# Altium schematic sheet 01_power.SchDoc
size A4; SheetNumber: 4; SheetTotal: 4
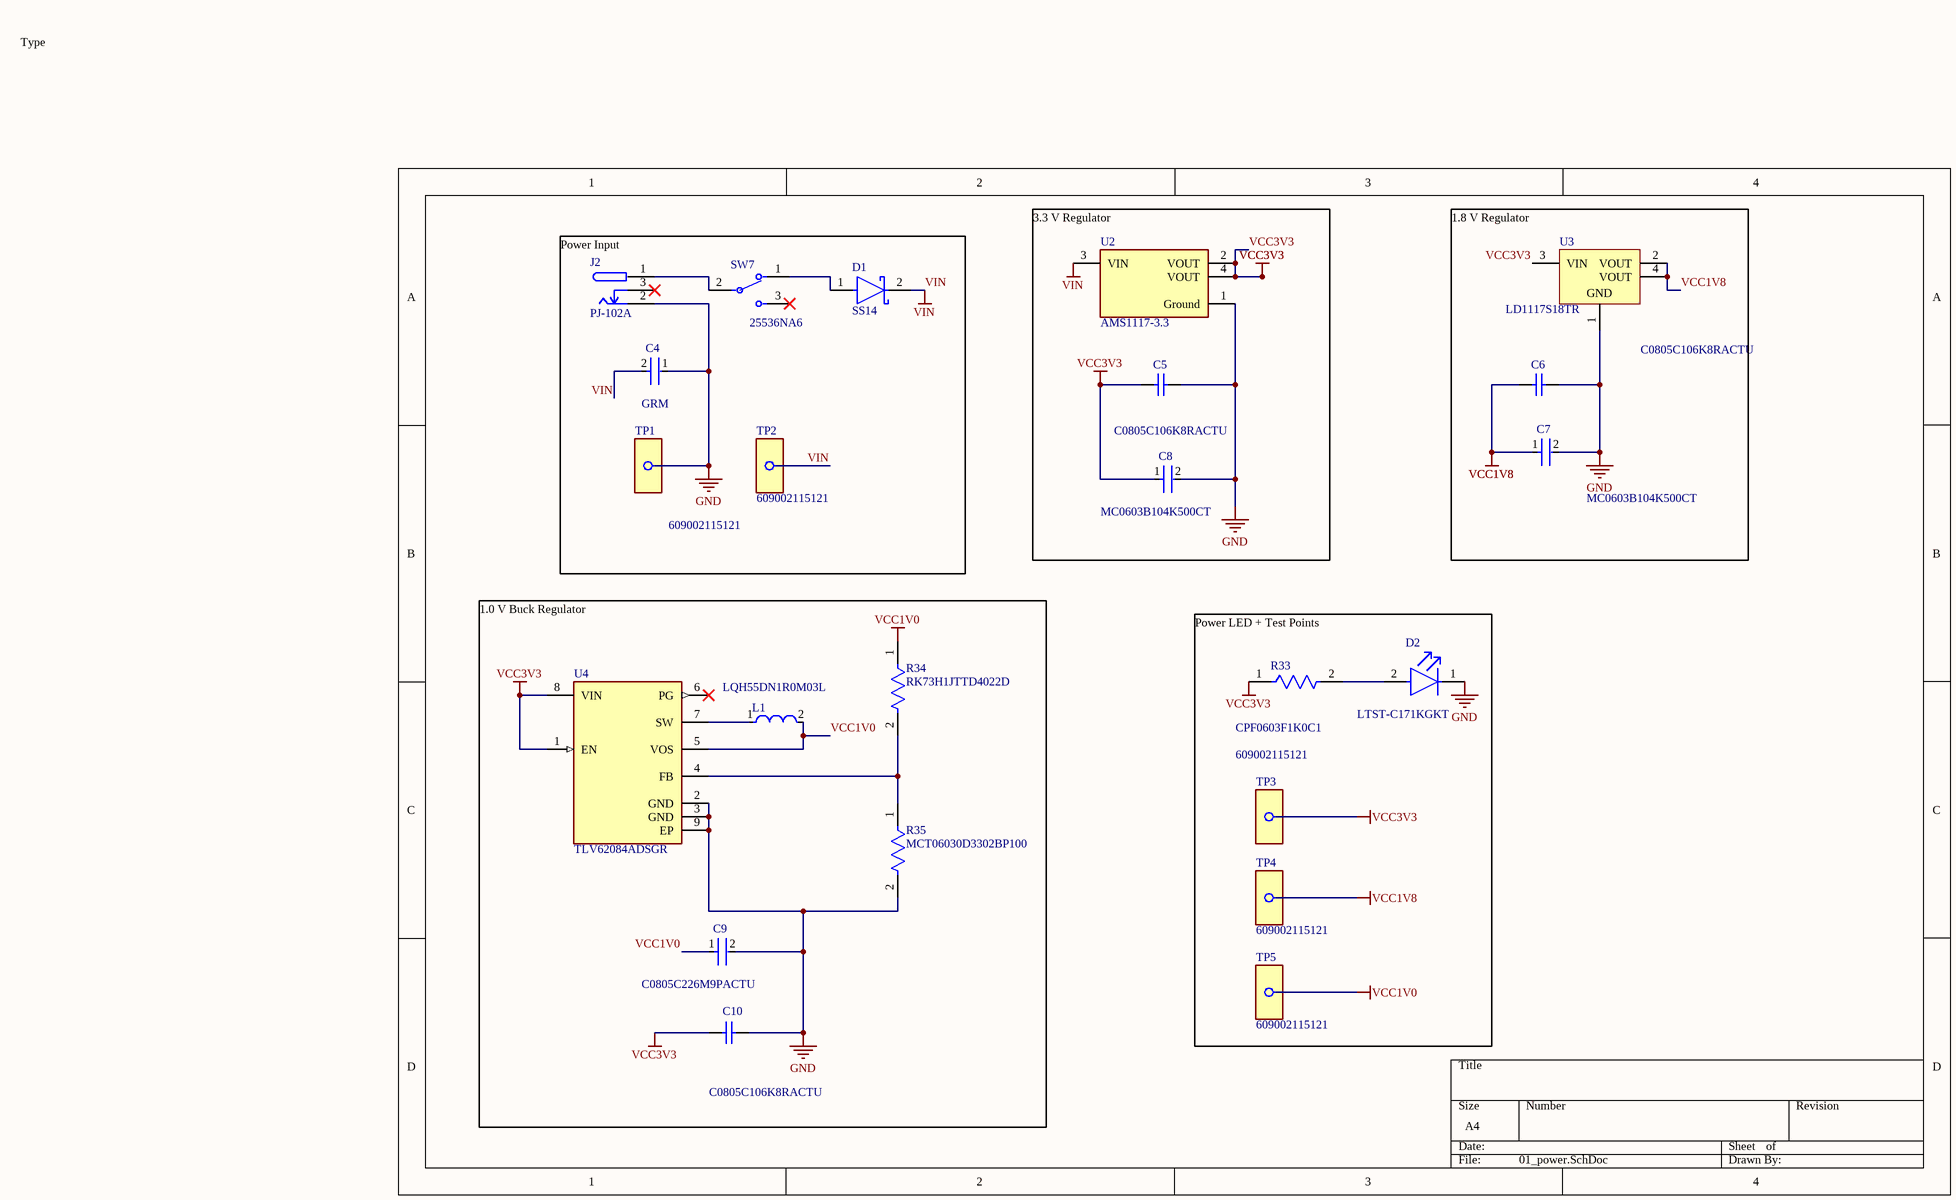
[diagram p0: 01_power.SchDoc]

## Parts
C4  GRM  [FP-GRM31C-0_3-e0_3_0_8-IPC_C]
C5  C0805C106K8RACTU  [CAPC2013X145X50LL20T25]
C6  C0805C106K8RACTU  [CAPC2013X145X50LL20T25]
C7  MC0603B104K500CT  [FP-MC0603-IPC_C]
C8  MC0603B104K500CT  [FP-MC0603-IPC_C]
C9  C0805C226M9PACTU  [FP-C0805C226M9PACTU-MFG]
C10  C0805C106K8RACTU  [CAPC2013X145X50LL20T25]
D1  SS14  [FP-403AE-MFG]
D2  LTST-C171KGKT  [FP-LTST-C171KGKT-MFG]
J2  PJ-102A  [FP-PJ-102A-MFG]
L1  LQH55DN1R0M03L  [FP-LQH55DN_03-MFG]
R33  CPF0603F1K0C1  [FP-CPF0603-MFG]
R34  RK73H1JTTD4022D  [FP-RK73H1J-MFG]
R35  MCT06030D3302BP100  [FP-MCT0603-IPC_B]
SW7  25536NA6  [FP-25536NA6-0]
TP1  609002115121  [FP-609002115121-MFG]
TP2  609002115121  [FP-609002115121-MFG]
TP3  609002115121  [FP-609002115121-MFG]
TP4  609002115121  [FP-609002115121-MFG]
TP5  609002115121  [FP-609002115121-MFG]
U2  AMS1117-3.3  [FP-AMS1117-IPC_C]
U3  LD1117S18TR  [SOT-223_M]
U4  TLV62084ADSGR  [FP-DSG0008A-IPC_C]

## Nets
GND: C4.1 C5.2 C6.2 C7.2 C8.2 C9.2 C10.2 D2.1(C) J2.2 R35.2 U2.1(Ground) U3.1(GND) U4.2(GND) U4.3(GND) U4.9(EP)
VCC1V0: C9.1 L1.2 R34.1 U4.5(VOS)
VCC1V8: C6.1 C7.1 U3.2(VOUT) U3.4(VOUT)
VCC3V3: C5.1 C8.1 C10.1 R33.1 U2.2(VOUT) U2.4(VOUT) U3.3(VIN) U4.1(EN) U4.8(VIN)
VIN: C4.2 D1.2(C) U2.3(VIN)
NetD1_1: D1.1(A) SW7.1
NetD2_2: D2.2(A) R33.2
NetJ2_1: J2.1 SW7.2
NetL1_1: L1.1 U4.7(SW)
NetR34_2: R34.2 R35.1 U4.4(FB)

Not connected (* = marked no-connect by the designer): J2 3*; SW7 3*; U4 6(PG)*

## Notes on the sheet
- Type @ to refer to a designator
- Power Input
- 3.3 V Regulator
- 1.8 V Regulator
- Power LED + Test Points
- 1.0 V Buck Regulator

## Library data of the parts
C4 = CMP-06035-011430-1: Chip Multilayer Ceramic Capacitors for General Purpose, 1206, 47uF, X5R, 15%, 20%, 16V; Capacitance: 47uF; Length: 3.2mm; Thickness: 1.6mm; Width: 1.6mm; Voltage Rating (DC): 16V; Tolerance: 20%; Dielectric: X5R
C5 C6 C10 = CMP-2007-01044-1: Manufacturer: Kemet; Part Number: C0805C106K8RACTU
C7 C8 = CMP-12266-000001-1: Ceramic Capacitor, Multilayer, Ceramic, 50V, 10% +Tol, 10% -Tol, X7R, -/+15ppm/Cel TC, 0.1uF, 0603; Capacitance: 100nF; Case Code (Imperial): 0603; Dielectric: X7R; Max Operating Temperature: 125°C; Packaging: Cut Tape; Min Operating Temperature: -55°C; Voltage Rating (DC): 50V; Tolerance: 10%; RoHS Compliant: Yes; Number of Pins: 2; Case/Package: 0603; Voltage Rating: 50V; Case Code (Metric): 1608
C9 = CMP-2007-01021-2: CAP CER 22UF 6.3V X5R 0805; Tolerance: 20%; Dielectric Material: Ceramic; Dissipation Factor: 5%; RoHS Compliant: Yes; Capacitance: 22uF; Packaging: Tape and Reel; Voltage: 6.3V; Package Quantity: 2500; Width: 1.2mm; Construction: Flat; Radiation Hardening: No; Lead Free: Lead Free; Voltage Rating (DC): 6.3V; Termination: SMD/SMT; Voltage Rating: 6.3V; Height: 1.25mm; Depth: 1.25mm; Max Operating Temperature: 85°C; Dielectric: X5R; Case/Package: 0805; Case Code (Imperial): 0805; Min Operating Temperature: -55°C; REACH SVHC: No SVHC; Mount: Surface Mount; Length: 2mm; Number of Pins: 2; Case Code (Metric): 2012
D1 = CMP-2000-04943-2: DIODE SCHOTTKY 40V 1A SMA; Manufacturer: ON Semiconductor; Peak Reverse Current: 0.2mA; Max Junction Temp: +125°C; Standoff Height: 0.05mm; Max Surge Forward Current: 40A; Mouser Description: Schottky Diodes & Rectifiers SMA 40V 1.0A; RoHS: TRUE; Lead Free: Yes; Manufacturer Part Number: SS14; Device Class L3: Schottky Diodes; Category: Diode; Automotive: No; Digikey Description: DIODE SCHOTTKY 40V 1A SMA; ComponentLink2Description: Datasheet; Device Class L2: Diodes; Height: 2.5mm; Temperature Range High: +125°C; ComponentLink2URL: https://www.onsemi.com/pub/Collateral/SS19-D.PDF; Device Class L1: Discrete Semiconductors; Package: 403AE; Octopart: https://octopart.com/ss14-on+semiconductor-29205033; Max Repetitive Reverse Voltage: 40V; Temperature Range Low: -65°C; Forward Current: 1A; Temperature: -65°C to +125°C
D2 = CMP-22017-000037-1: LED GREEN CLEAR SMD; Number of LEDs: 1; Viewing Angle: 130°; Lens Style: Rectangular; Dominant Wavelength: 571nm; Test Current: 20mA; Luminous Intensity: 35mcd; Power Rating: 75mW; Forward Voltage: 2.4V; Forward Current: 30mA; Reverse Voltage: 5V; Lens Color: Colorless; Wavelength: 574nm; Height: 0.8mm; Illumination Color: Green; Length: 2mm; Case/Package: 0805; Number of Pins: 2; Number of Elements: 1; Package Quantity: 1; Depth: 1.25mm; Lens Transparency: Clear; Width: 1.25mm; Color: Green; Radiation Hardening: No; Mount: Surface Mount; Packaging: Tape and Reel; Case Code (Metric): 2012; Lead Free: Lead Free; Max Operating Temperature: 85°C; Min Operating Temperature: -55°C; Case Code (Imperial): 0805; Power Dissipation: 75mW
J2 = CMP-12637-106234071-1: PJ-102A 2.0 x 6.5 mm, 2.5 A, Horizontal, Through Hole, Tapered Pins, Dc Power Jack Connector; Voltage Rating (DC): 24V; Number of Contacts: 3; Outside Diameter: 6.5mm; Gender: Male; Shielding: No; Insulation Resistance: 50MΩ; Current Rating: 2.5A; Inside Diameter: 2mm; Number of Conductors: 2; Housing Color: Black; RoHS: Compliant; Diameter: 2.1mm; Mount: Through Hole; Contact Plating: Nickel; NexarPartId: 106234071; Voltage Rating: 24V; Housing Material: Thermoplastic; Max Operating Temperature: 85°C; Color: Black; Contact Material: Copper, Nickel, Tin; Orientation: Horizontal; Packaging: Bulk; Flammability Rating: UL94 V-0; Schedule B: 8536695050, 8536695050; Contact Gender: Male; Lead Free: Lead Free; Termination: Through Hole; Min Operating Temperature: -25°C; Height: 11.2mm; Lifecycle Status: Production
L1 = CMP-06042-004508-1: Wire Wound Ferrite Inductor for Power Lines 1μH ±20% 0.0266Ω  4.0A 2220; Current Rating: 4A; Series Resistance: 19mR; DC Resistance (DCR): 26.6mR; Inductance: 1uH; Shielding: Unshielded; Test Frequency: 1MHz; Self Resonant Frequency: 150MHz; Mount: Surface Mount; Depth: 5.3mm; Weight: 0.016932oz; Min Operating Temperature: -40°C; Number of Pins: 2; Max Operating Temperature: 80°C; Military Standard: Not; Tolerance: 20%; Length: 5.7mm; Height - Seated (Max): 0.198inch; Packaging: Tape and Reel; Case/Package: 2220; DC Current: 4A; Max DC Current: 4A; Lead Free: Lead Free; Resistor Type: Wirewound; Width: 0.197inch; Case Code (Metric): 5750; REACH SVHC: No SVHC; Package Quantity: 350; Inductance Tolerance: 20%; Radiation Hardening: No; Case Code (Imperial): 2220; Termination: SMD/SMT; Core Material: Ferrite; Height: 4.7mm
R33 = CMP-03211-002621-1: RES SMD 1.0KΩ 1% 1/16W 0603; Manufacturer: TE Connectivity; Power Rating: 0.063W; Voltage Rating: 50V; Temperature Coefficient: 50ppm/°C; Octopart: https://octopart.com/cpf0603f1k0c1-te+connectivity-42013134; packaging: 1k Reel; Category: Res; Device Class L3: Chip SMD Resistors; octopart_url: https://octopart.com/cpf0603f1k0c1-te+connectivity-42013134; Value: 1.0KΩ; Temperature: -55°C to +155°C; Composition: Thin Film; ComponentLink2URL: https://www.te.com/commerce/DocumentDelivery/DDEController?Action=showdoc&DocId=Data+Sheet%7F1773200%7FM%7Fpdf%7FEnglish%7FENG_DS_1773200_M.pdf%7F3-1676481-2; Tolerance: 1%; Automotive: No; Lead Free: Yes; Height: 0.55mm; Device Class L1: Passive Components; Device Class L2: Resistors; Ipc Land Pattern Name: RESC15580X45; Series: CPF; ComponentLink2Description: Datasheet; RoHS: TRUE; Resistance: 1.0KΩ; Package: CPF0603; Manufacturer Part Number: CPF0603F1K0C1; Temperature Range Low: -55°C; Temperature Range High: +155°C
R34 = CMP-04015-087673-1: 40.2kΩ ±0.5% 0.1W Chip Resistor 0603 Thick Film AEC-Q200 Qualified; Resistance: 40.2kR; Temperature Coefficient: 100ppm/°C; Voltage Rating (DC): 50V; Power Rating: 100mW; Length: 1.6mm; Width: 0.8mm; Series: RK73H; Case Code (Imperial): 0603; Min Operating Temperature: -55°C; Height: 0.45mm; Packaging: Tape and Reel; Case/Package: 0603; Max Operating Temperature: 155°C; Tolerance: 0.5%; Voltage Rating: 50V; Package Quantity: 5000; Lead Free: Lead Free; Case Code (Metric): 1608; Termination: SMD/SMT
R35 = CMP-02407-009226-1: RES SMD 100 OHM 1% 1/8W 0603; Temperature Coefficient: 25ppm/°C; Resistance: 33kR; Tolerance: 0.1%; Power Rating: 100mW; Depth: 0.85mm; Composition: Thin Film; Radiation Hardening: No; Case/Package: 0603; Min Operating Temperature: -55°C; Length: 1.55mm; Width: 850um; Contact Plating: Tin; Military Standard: Not; Packaging: Tape and Reel; Mount: Surface Mount; Height: 0.45mm; Lead Free: Lead Free; Max Operating Temperature: 125°C
SW7 = CMP-47022-000007-1: SWITCH SLIDE SPDT 4A 125V; Current Rating: 1A; Voltage Rating (DC): 30V; Mechanical Life: 20000Cycles; Contact Resistance: 10mR; Electrical Life: 10000Cycles; Switch Function: On-On; Actuator Material: Nylon; Actuator Length: 6mm; Illumination Type: Non-Illuminated; Switch Travel: 4mm; Actuator Type: Standard; Max Voltage Rating (AC): 250V; Min Operating Temperature: -40°C; Max Voltage Rating (DC): 30V; Contact Current Rating: 4A; Series: 25000N; Termination: PC Pin; Orientation: Right Angle; Contact Plating: Silver; Throw Configuration: SPDT; Max Operating Temperature: 85°C; Contact Material: Silver; Packaging: Bulk; Mount: Through Hole; Voltage Rating (AC): 125V; Package Quantity: 100
TP1-TP5 = CMP-207973-000004-1: WR-PHD_2.54MM_JUMPER_BLACK W/ TE; Voltage Rating (AC): 250V; Series: WR-PHD; Housing Material: PBT; RoHS Compliant: Yes; Color: Black; Flammability Rating: UL94 V-0; Contact Plating: Gold
U2 = CMP-209535-000001-1: LDO Voltage Regulators 1A, 3.3V; Manufacturer: Advanced Monolithic Systems; Dropout Voltage: 1.1V; Output Type: Fixed; Nominal Supply Current: 5mA; Max Power Dissipation: 1.2W; Max Supply Voltage: 15V; Number Of Outputs: 1; Standoff Height: 0.64mm; Max Junction Temp: +125°C; Height: 1.8mm; Package: AMS1117; Device Class L2: Power Management ICs; ComponentLink2Description: Datasheet; ComponentLink2URL: http://www.advanced-monolithic.com/pdf/ds1117.pdf; Category: IC; RoHS: TRUE; Automotive: No; Device Class L1: Integrated Circuits (ICs); Output Current: 1A; Device Class L3: Voltage Regulators - Linear; Temperature: -40°C to +125°C; Output Voltage: 3.3V; Manufacturer Part Number: AMS1117-3.3; Temperature Range Low: -40°C; Octopart: https://octopart.com/ams1117-3.3-advanced+monolithic+systems-25899300; Lead Free: Yes; Ipc Land Pattern Name: SOT229P700X180-4; Temperature Range High: +125°C
U3 = CMP-0244-00308-1: Fixed Low Drop Positive Voltage Regulator, 1.8V, 4-Pin SOT-223, Tape and Reel; ComponentLink1URL: http://www.st.com; PackageReference: SOT-223; PackageDescription: 4-Pin SOT-223 Package, 6.5 x 3.5 mm Body, 2.3 mm Pitch, 7 mm Lead Span; ComponentLink2URL: http://www.st.com/internet/com/TECHNICAL_RESOURCES/TECHNICAL_LITERATURE/DATASHEET/CD00000544.pdf; ComponentLink2Description: Datasheet; ComponentLink1Description: Manufacturer URL; DatasheetVersion: 1/11/2011; PackageVersion: 2010
U4 = CMP-04918-000161-1: IC REG BUCK ADJUSTABLE 2A 8WSON; Min Input Voltage: 2.7V; Number of Outputs: 1; Max Input Voltage: 6V; Switching Frequency: 2MHz; Output Configuration: Positive; Synchronous Rectifier: Yes; Quiescent Current: 30uA; Min Output Voltage: 500mV; Max Output Voltage: 4V; Output Type: Adjustable; Output Current: 2A; Min Operating Temperature: -40°C; Lead Free: Lead Free; Max Operating Temperature: 125°C; Mount: Surface Mount